# Altium schematic sheet 06-GPS.SchDoc
size A; SheetNumber: 6; SheetTotal: 10
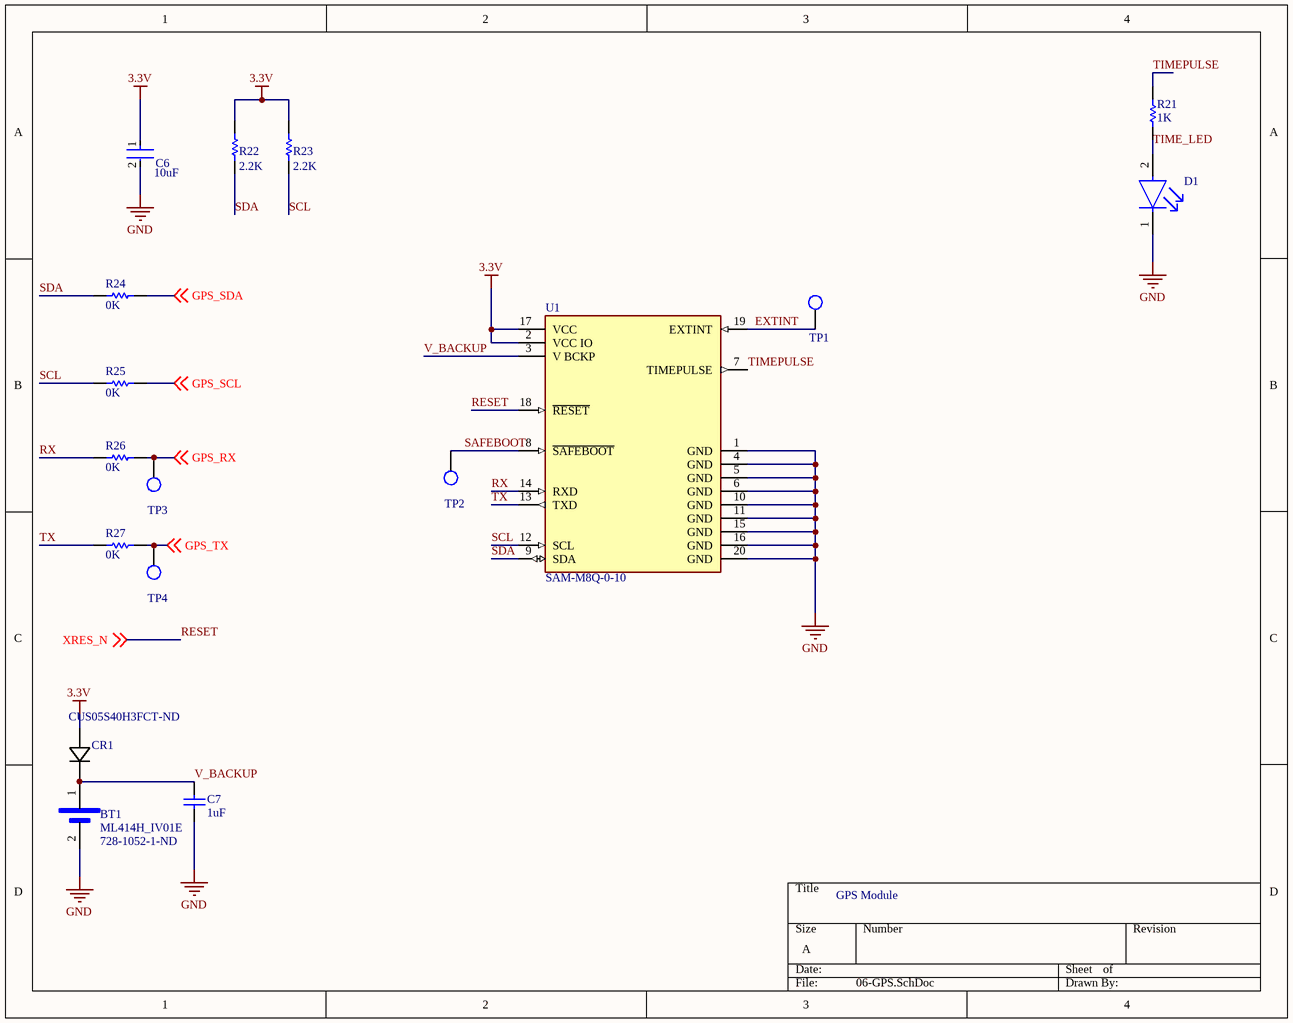
[diagram p0: 06-GPS.SchDoc]

## Parts
BT1  ML414H_IV01E  Supplier Part Number 1: 728-1052-1-ND  [SEIKO_ML414H_IV01E]
C6  Capacitance: 10uF  [FP-CL21-IPC_B]  (hidden comment: CL21A106KQCLNNC)
C7  1uF  [CAPC2013X145X50LL20T25]
CR1  Supplier Part Number 1: CUS05S40H3FCT-ND  [USC_TOS]  (hidden comment: CUS05S40)
D1  APHCM2012SYCK-F01  [FP-APHCM2012SYCK-F01-MFG]  (value not drawn)
R21  1K  [RESC2013X60X35ML10T20]
R22  2.2K  [RESC2013X70X40LL20T20]
R23  2.2K  [RESC2013X70X40LL20T20]
R24  0K  [RESC2013X50X30LL20T20]
R25  0K  [RESC2013X50X30LL20T20]
R26  0K  [RESC2013X50X30LL20T20]
R27  0K  [RESC2013X50X30LL20T20]
TP1  TP_1206  [TP-SMC-1206]  (value not drawn)
TP2  TP_1206  [TP-SMC-1206]  (value not drawn)
TP3  TP_1206  [TP-SMC-1206]  (value not drawn)
TP4  TP_1206  [TP-SMC-1206]  (value not drawn)
U1  SAM-M8Q-0-10  [FP-SAM-M8Q-0-10-MFG]

## Nets
3.3V: C6.1 CR1.2(anode) R22.2 R23.2 U1.2(VCC_IO) U1.17(VCC)
GND: BT1.2(NEG) C6.2 C7.2 D1.1(C) U1.1(GND) U1.4(GND) U1.5(GND) U1.6(GND) U1.10(GND) U1.11(GND) U1.15(GND) U1.16(GND) U1.20(GND)
EXTINT: TP1.1 U1.19(EXTINT)
GPS_RX: R26.2 TP3.1 ; off-sheet GPS_RX
GPS_SCL: R25.2 ; off-sheet GPS_SCL
GPS_SDA: R24.2 ; off-sheet GPS_SDA
GPS_TX: R27.2 TP4.1 ; off-sheet GPS_TX
RESET: U1.18(~{RESET}) ; off-sheet XRES_N  [also labelled XRES_N]
RX: R26.1 U1.14(RXD)
SAFEBOOT: TP2.1 U1.8(~{SAFEBOOT})
SCL: R23.1 R25.1 U1.12(SCL)
SDA: R22.1 R24.1 U1.9(SDA)
TIME_LED: D1.2(A) R21.1
TIMEPULSE: R21.2 U1.7(TIMEPULSE)
TX: R27.1 U1.13(TXD)
V_BACKUP: BT1.1(POS) C7.1 CR1.1(cathode) U1.3(V_BCKP)

## Notes on the sheet
- GPS Module

## Library data of the parts
BT1 = ML414H_IV01E: Coin, 4.8mm 3V Lithium Battery Rechargeable _Secondary_ 1mAh; MP: ML414H IV01E; MF: Seiko Instruments; Package: SOT-89 Seiko; SnapEDA_Link: https://www.snapeda.com/parts/ML414H%20IV01E/Seiko%20Instruments/view-part/1015565/?ref=snap; Availability: Unavailable; Price: None; Value: *; Supplier 1: Digi-Key
C6 = CMP-13271-003047-1: CL21 Series 0805 10uF 6.3V ±10% Tolerance X5R Multilayer Ceramic Chip Capacitor; Lead Free: Lead Free; Mount: Surface Mount; Case/Package: 0805; Packaging: Tape and Reel; Max Operating Temperature: 85°C; Min Operating Temperature: -55°C; Voltage Rating: 6.3V; Case Code (Metric): 2012; Radiation Hardening: No; Tolerance: 10%; Package Quantity: 1; Depth: 1.25mm; Width: 0.049inch; Dielectric: X5R; Height: 0.85mm; Case Code (Imperial): 0805; Length: 2mm; Thickness: 0.037inch
C7 = CMP-1036-04746-2: Manufacturer: Kemet; Part Number: C0805C105K4PACTU
CR1 = CUS05S40: No Description Available; Mfr_Name: Toshiba Electronic Devices & Storage Corp.; Type: DEV; Copyright: Copyright (C) 2022 Ultra Librarian. All rights reserved.; Manufacturer_Part_Number: CUS05S40; Digi-Key_Part_Number_1: CUS05S40H3FCT-ND; Digi-Key_Part_Number_2: CUS05S40H3FDKR-ND; Digi-Key_Part_Number_3: CUS05S40H3FTR-ND; RefDes: RefDes; Supplier 1: Digi-Key
D1 = CMP-44529-000064-1: LED YELLOW CLEAR CHIP SMD; Number of LEDs: 1; Luminous Intensity: 150mcd; Dominant Wavelength: 590nm; Test Current: 20mA; Illumination Color: Green; Forward Voltage: 2V; Viewing Angle: 110°; Number of Pins: 2; Packaging: Tape and Reel; Width: 1.25mm; Height: 0.4mm; Lens Color: Clear; RoHS Compliant: Yes; Lead Free: Lead Free; Min Operating Temperature: -40°C; Case Code (Imperial): 0805; Case/Package: 0805; Series: APHCM; Wavelength: 590nm; Max Operating Temperature: 85°C; Length: 2mm; Color: Yellow; Package Quantity: 2000; Mount: Surface Mount; Lens Style: Clear; Forward Current: 20mA; Case Code (Metric): 2012
R21 = CMP-2100-03671-1: Chip Resistor, 1 KOhm, +/- 1%, 125 mW, -55 to 155 degC, 0805 (2012 Metric), RoHS, Tape and Reel; Manufacturer: Yageo; Temperature Coefficient: 100ppm/degreesC; Voltage Rating (DC): 150V; Max Power Dissipation: 125mW; Resistance: 1KOhm; Number of Pins: 2; Number of Terminations: 2; Datasheet URL: http://www.yageo.com/NewPortal/yageodocoutput?fileName=/pdf/R-Chip/PYu-RC_Group_51_RoHS_L_5.pdf; Length: 0.079inch; Package Description: 2-Pin Surface Mounted Device, Body 2 x 1.25 mm; Depth: 1.25mm; Height: 0.024inch; Military Standard: Not; Case/Package: 0805; Package Reference: 0805; RoHSCompliant: true; Lead Free: LeadFree; Packaging: TapeandReel; Package Quantity: 1; Datasheet Version: Rev. 5, 10/2016; Tolerance: 1%; Min Operating Temperature: -55degC; Voltage Rating: 150V; Composition: ThickFilm; Case Code (Imperial): 0805; Power Rating: 125mW; Width: 0.049inch; Case Code (Metric): 2012; Manufacturer URL: http://www.yageo.com/; Max Operating Temperature: 155degC; REACH SVHC: Unknown; Termination: SMD/SMT
R22 R23 = CMP-2001-00376-1: ERJ-6GEYJ222V; Manufacturer: Panasonic; Part Number: ERJ-6GEYJ222V
R24-R27 = CMP-2001-04896-1: Manufacturer: Vishay Dale; Part Number: CRCW08050000Z0EA
TP1-TP4 = TP_1206: Test Point SMD 1206; Manufacturer: TE Connectivity (Tyco Electronics); Manufacturer Part Number: 1625854-1; Resistance Value: 0 Ohm; Temperature Coefficient: N/R; Supplier: Digi-Key; Stock 1: 31937; Pricing 1: 1=0.28, 10=0.261, 25=0.224, 50=0.1902, 100=0.1828, 250=0.1641, 500=0.1567, 1000=0.1306 (USD); Case Size: 1206; Dimension: 3.2 x 1.6 x 1.25mm; Family: RC; Mounting: Surface Mount; Operating Temperature: -55 to 125 C; Part No: 1625854-1; RoHS: Yes; Packaging: Tape and Reel; Termination Style: N/R; Terminal Pitch: N/R; Power Rating: N/R; Tolerance: N/R; ComponentLink1URL: https://datasheet.ciiva.com/6439/eng-ds-1773266-a-6439169.pdf; ComponentLink1Description: https://datasheet.ciiva.com/6439/eng-ds-1773266-a-6439169.pdf; ComponentLink2URL: https://datasheet.ciiva.com/30136/1773266-a-30136341.pdf; ComponentLink2Description: https://datasheet.ciiva.com/30136/1773266-a-30136341.pdf; ComponentLink3URL: https://datasheet.ciiva.com/6439/eng-ds-1773266-a-6439080.pdf; ComponentLink3Description: https://datasheet.ciiva.com/6439/eng-ds-1773266-a-6439080.pdf; ComponentLink4URL: https://datasheet.ciiva.com/6439/eng-ds-1773266-a-6439081.pdf; ComponentLink4Description: https://datasheet.ciiva.com/6439/eng-ds-1773266-a-6439081.pdf; ComponentLink5URL: https://datasheet.ciiva.com/6439/eng-ds-1773266-a-6439083.pdf; ComponentLink5Description: https://datasheet.ciiva.com/6439/eng-ds-1773266-a-6439083.pdf; Supplier Part Number: A106143CT-ND; Supplier 1: Digi-Key; Supplier Part Number 1: A106143CT-ND
U1 = CMP-207130-000004-3: RF RX GALILEO 1.575GHZ/1.602GHZ; Manufacturer: uBlox; Nominal Supply Current: 9.5-32mA; Sensitivity: -165dBm; Automotive Grade: Grade 3; Max Frequency: 1602MHz; Min Supply Voltage: 2.7V; Max Supply Voltage: 3.6V; Data Rate: 400kbits/s; Interface: I2C,UART,Other; Package: 0; ComponentLink2Description: Datasheet; Octopart: https://octopart.com/sam-m8q-0-10-u-blox-88247750; Temperature Range Low: -40°C; Height: 6.8mm; Category: IC; RoHS: TRUE; Digikey Description: RF RX GALILEO 1.575GHZ/1.602GHZ; Footprint Url: https://www.u-blox.com/sites/default/files/SAM-M8Q_HardwareIntegrationManual_%28UBX-16018358%29.pdf; ComponentLink2URL: https://www.u-blox.com/sites/default/files/SAM-M8Q_DataSheet_%28UBX-16012619%29.pdf; Temperature Range High: +85°C; Device Class L1: Integrated Circuits (ICs); Temperature: -40°C to +85°C; Automotive: Yes; Device Class L2: RF Semiconductors and Devices; Manufacturer Part Number: SAM-M8Q-0-10; Device Class L3: Transceivers; Lead Free: Yes